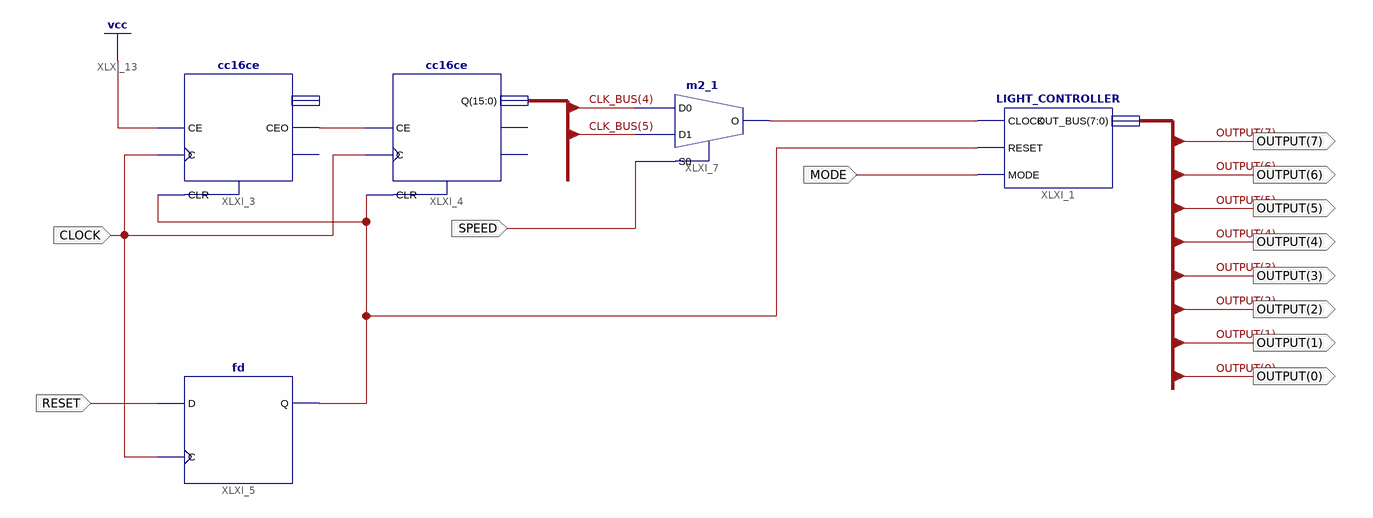
[diagram p0: schematic sheet 1]
// Xilinx ISE schematic TOP_SCHEME.sch (spartan3a) as structural Verilog: 5 symbols, 12 ports
module TOP_SCHEME (
  input  CLOCK,
  input  RESET,
  input  SPEED,
  input  MODE,
  output [7:0] OUTPUT
);

  wire XLXN_25, XLXN_32, XLXN_39;
  wire [15:0] CLK_BUS;

  cc16ce XLXI_3 (.C(CLOCK), .CE(1'b1), .CLR(XLXN_32), .CEO(XLXN_25));  // open: Q, TC
  cc16ce XLXI_4 (.C(CLOCK), .CE(XLXN_25), .CLR(XLXN_32), .Q(CLK_BUS));  // open: CEO, TC
  fd XLXI_5 (.C(CLOCK), .D(RESET), .Q(XLXN_32));
  m2_1 XLXI_7 (.D0(CLK_BUS[4]), .D1(CLK_BUS[5]), .S0(SPEED), .O(XLXN_39));
  LIGHT_CONTROLLER XLXI_1 (.CLOCK(XLXN_39), .RESET(XLXN_32), .MODE(MODE), .OUT_BUS(OUTPUT));
endmodule
